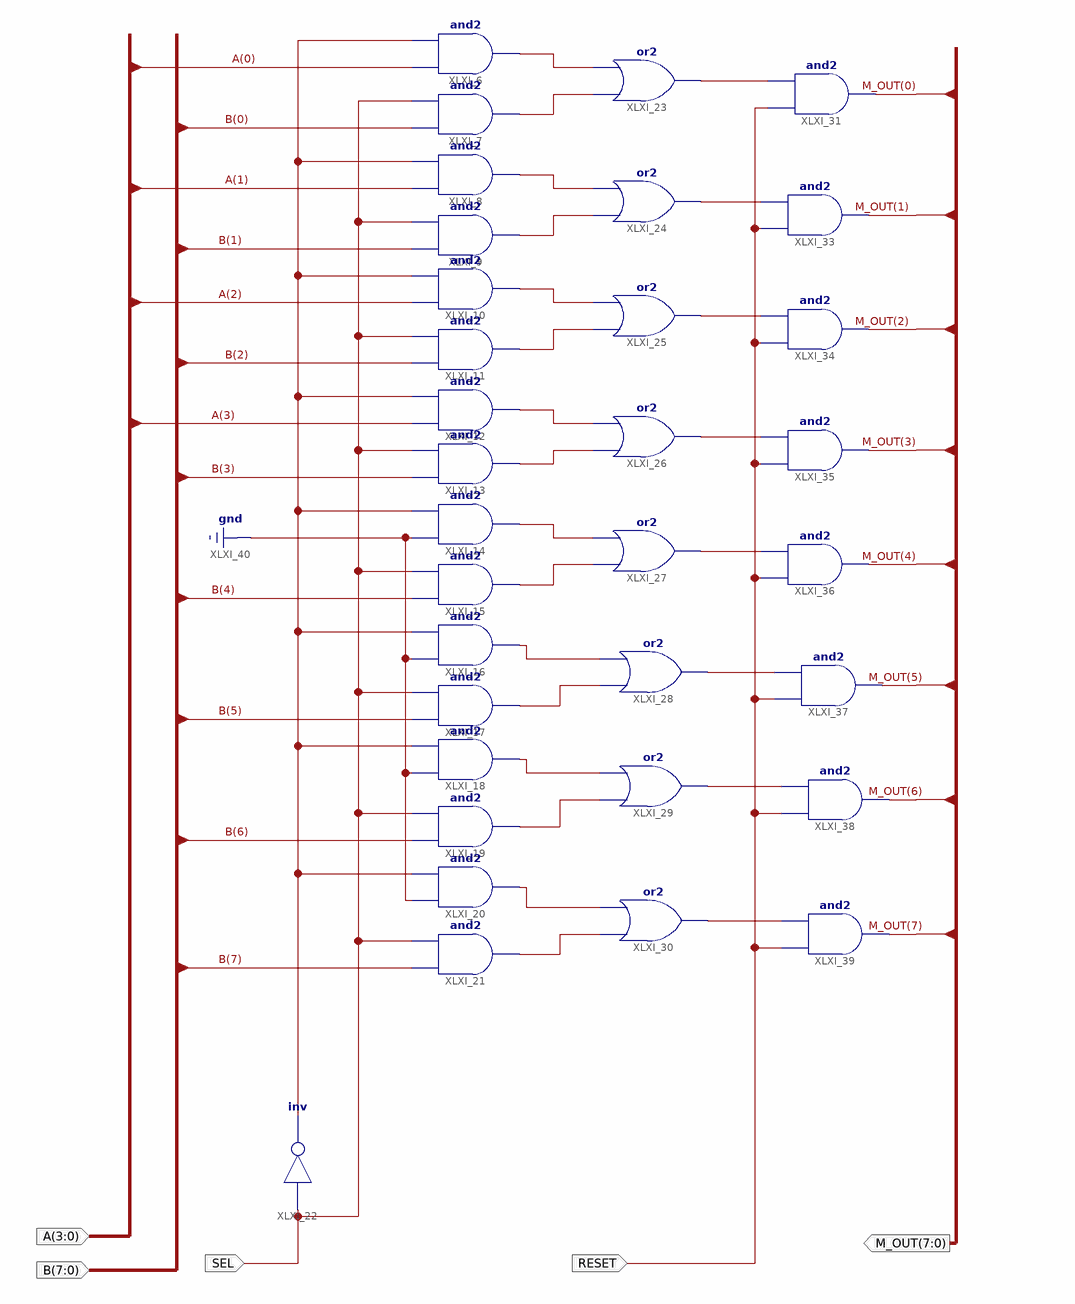
[diagram p0: schematic sheet 1]
// Xilinx ISE schematic Two_to_One_MUX_Eight_Bit.sch (spartan6) as structural Verilog: 33 symbols, 5 ports
module Two_to_One_MUX_Eight_Bit (
  input  SEL,
  input  [3:0] A,
  input  [7:0] B,
  input  RESET,
  output [7:0] M_OUT
);

  wire XLXN_17, XLXN_37, XLXN_38, XLXN_39, XLXN_40, XLXN_41, XLXN_42, XLXN_43, XLXN_44, XLXN_45, XLXN_46,
       XLXN_49, XLXN_50, XLXN_52, XLXN_53, XLXN_55, XLXN_56, XLXN_57, XLXN_58, XLXN_59, XLXN_60, XLXN_61,
       XLXN_62, XLXN_63, XLXN_65;

  and XLXI_6 (XLXN_37, A[0], XLXN_17);
  and XLXI_7 (XLXN_38, B[0], SEL);
  and XLXI_8 (XLXN_39, A[1], XLXN_17);
  and XLXI_9 (XLXN_40, B[1], SEL);
  and XLXI_10 (XLXN_41, A[2], XLXN_17);
  and XLXI_11 (XLXN_42, B[2], SEL);
  and XLXI_12 (XLXN_43, A[3], XLXN_17);
  and XLXI_13 (XLXN_44, B[3], SEL);
  and XLXI_14 (XLXN_45, 1'b0, XLXN_17);
  and XLXI_15 (XLXN_46, B[4], SEL);
  and XLXI_16 (XLXN_49, 1'b0, XLXN_17);
  and XLXI_17 (XLXN_50, B[5], SEL);
  and XLXI_18 (XLXN_52, 1'b0, XLXN_17);
  and XLXI_19 (XLXN_53, B[6], SEL);
  and XLXI_20 (XLXN_55, 1'b0, XLXN_17);
  and XLXI_21 (XLXN_56, B[7], SEL);
  not XLXI_22 (XLXN_17, SEL);
  or XLXI_23 (XLXN_57, XLXN_38, XLXN_37);
  or XLXI_24 (XLXN_58, XLXN_40, XLXN_39);
  or XLXI_25 (XLXN_59, XLXN_42, XLXN_41);
  or XLXI_26 (XLXN_60, XLXN_44, XLXN_43);
  or XLXI_27 (XLXN_61, XLXN_46, XLXN_45);
  or XLXI_28 (XLXN_63, XLXN_50, XLXN_49);
  or XLXI_29 (XLXN_62, XLXN_53, XLXN_52);
  or XLXI_30 (XLXN_65, XLXN_56, XLXN_55);
  and XLXI_31 (M_OUT[0], RESET, XLXN_57);
  and XLXI_33 (M_OUT[1], RESET, XLXN_58);
  and XLXI_34 (M_OUT[2], RESET, XLXN_59);
  and XLXI_35 (M_OUT[3], RESET, XLXN_60);
  and XLXI_36 (M_OUT[4], RESET, XLXN_61);
  and XLXI_37 (M_OUT[5], RESET, XLXN_63);
  and XLXI_38 (M_OUT[6], RESET, XLXN_62);
  and XLXI_39 (M_OUT[7], RESET, XLXN_65);
endmodule
